# Altium schematic sheet conn_sdcard.SchDoc
size A
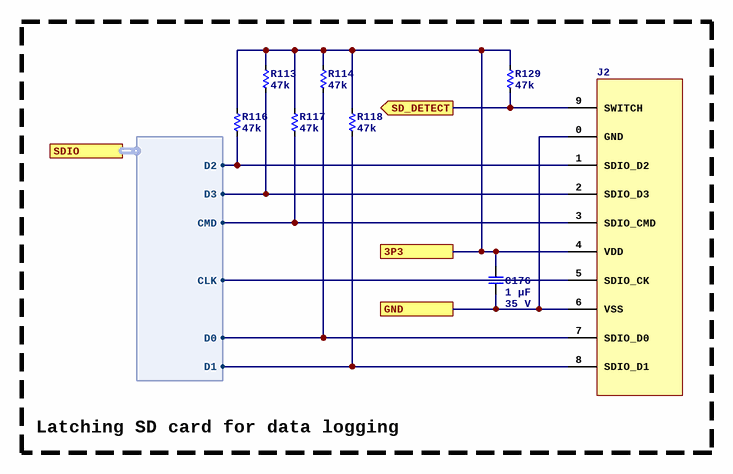
[diagram p0: conn_sdcard.SchDoc]

## Parts
C176  Capacitance: 1 µF  Voltage Rating: 35 V  [C0603]  (hidden comment: GMK107AB7105KAHT)
J2  DM3BT-DSF-PEJS  [HIROSE_DM3BT]  (value not drawn)
R113  value 47k  [R0402]  (hidden comment: 0402WGF4702TCE)
R114  value 47k  [R0402]  (hidden comment: 0402WGF4702TCE)
R116  value 47k  [R0402]  (hidden comment: 0402WGF4702TCE)
R117  value 47k  [R0402]  (hidden comment: 0402WGF4702TCE)
R118  value 47k  [R0402]  (hidden comment: 0402WGF4702TCE)
R129  value 47k  [R0402]  (hidden comment: 0402WGF4702TCE)

## Blocks framed on the sheet
Latching SD card for data logging: C176 J2 R113 R114 R116-R118 R129

## Ports
3P3, GND, SD_DETECT (out), SDIO (harness SDIO)

## Harnesses
SDIO: CLK, D0, D1, CMD, D2, D3

## Nets
3P3: C176.1 J2.4(VDD) R113.2 R114.2 R116.2 R117.2 R118.2 R129.2 ; port 3P3
GND: C176.2 J2.0(GND) J2.6(VSS) ; port GND
SD_DETECT: J2.9(SWITCH) R129.1 ; port SD_DETECT
NetJ2_1: J2.1(SDIO_D2) R116.1 ; port SDIO.D2
NetJ2_2: J2.2(SDIO_D3) R113.1 ; port SDIO.D3
NetJ2_3: J2.3(SDIO_CMD) R117.1 ; port SDIO.CMD
NetJ2_5: J2.5(SDIO_CK) ; port SDIO.CLK
NetJ2_7: J2.7(SDIO_D0) R114.1 ; port SDIO.D0
NetJ2_8: J2.8(SDIO_D1) R118.1 ; port SDIO.D1

## Library data of the parts
C176 = GMK107AB7105KAHT: Manufacturer: Taiyo Yuden; Dielectric: X7R; ComponentLink1URL: https://datasheet.lcsc.com/lcsc/2304140030_Taiyo-Yuden-GMK107AB7105KAHT_C841050.pdf; ComponentLink1Description: Datasheet; Manufacturer Part Number: GMK107AB7105KAHT; Package: 0603; Supplier 2: LCSC; Supplier Part Number 2: C841050
J2 = DM3BT-DSF-PEJS: CONN MICRO SD R/A PUSH-PUSH SMD; Manufacturer: Hirose Electric Co Ltd; Supplier 1: DigiKey; ComponentLink1URL: http://www.hirose.co.jp/cataloge_hp/e60900232.pdf; ComponentLink1Description: Datasheet; Supplier Part Number 1: HR1942CT-ND; Manufacturer Part Number: DM3BT-DSF-PEJS; Supplier 2: LCSC; Supplier Part Number 2: C597972; Supplier 3: Mouser; Supplier Part Number 3: 798-DM3BT-DSF-PEJS
R113 R114 R116-R118 R129 = 0402WGF4702TCE: Manufacturer: UNI-ROYAL(Uniroyal Elec); Tolerance: 1%; Temperature Coefficient: ±100ppm/?; Power Rating (mW): 62.5; ComponentLink1Description: Datasheet; ComponentLink1URL: https://wmsc.lcsc.com/wmsc/upload/file/pdf/v2/lcsc/2206010100_UNI-ROYAL-Uniroyal-Elec-0402WGF4702TCE_C25792.pdf; Manufacturer Part Number: 0402WGF4702TCE; Package: 0402; Supplier 2: LCSC; Supplier Part Number 2: C25792